# Altium project OLED_Xplained_PRO.PrjPCB
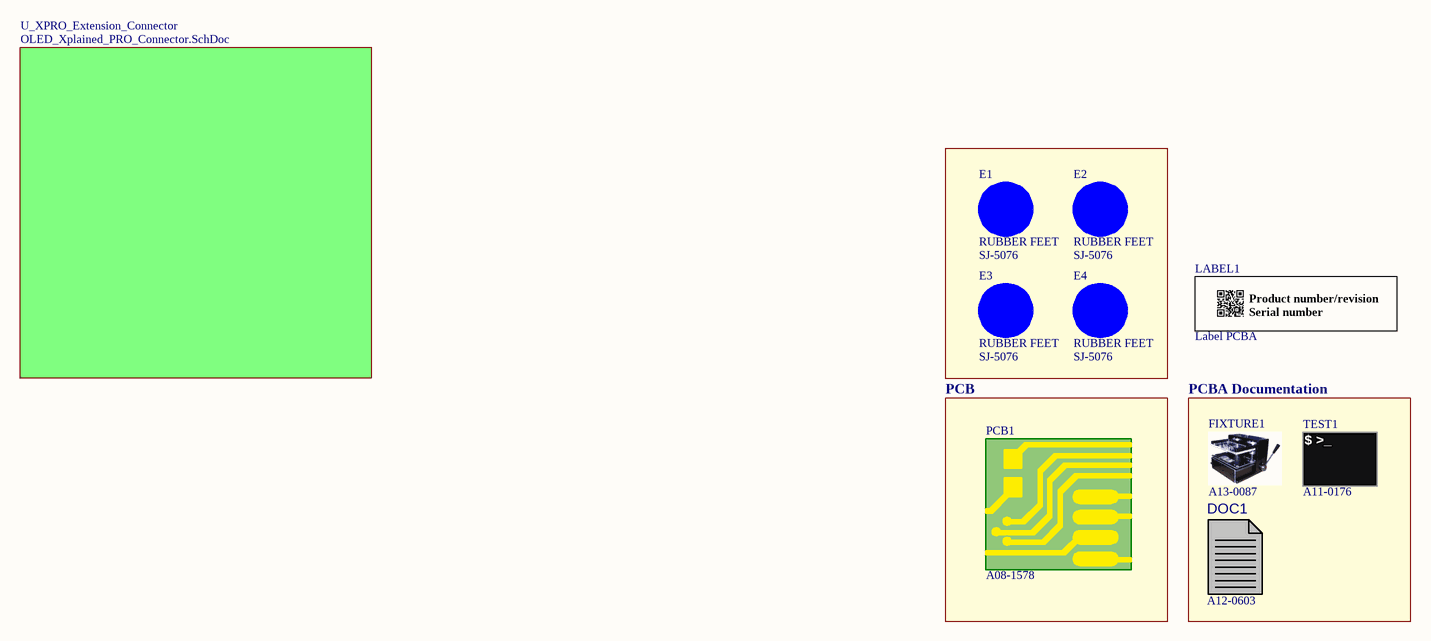
[diagram p0: OLED_Xplained_PRO_TopLevel.SchDoc]
2 sheets, 41 parts. Net scope: global (net labels, ports and power ports of the same name join across sheets).
Board file: OLED_Xplained_PRO.PcbDoc
Sheets:
  OLED_Xplained_PRO_TopLevel.SchDoc
    U_XPRO_Extension_Connector = OLED_Xplained_PRO_Connector.SchDoc

## Sheet OLED_Xplained_PRO_TopLevel.SchDoc: OLED Xplained PRO
size A3; Organization: ATMEL Norway; Address1: Vestre Rosten 79; Address2: N-7075 TILLER; Address3: NORWAY; DocumentNumber: 1; Revision: 3; SheetNumber: 1; SheetTotal: 2; PageSetup: Record=PageOptions|CenterHorizontal=True|CenterVertical=True|PrintScale=1.01|XCorrection=1.00|YCorrection=1.00|PrintKind=1|BorderSize=5000000|LeftOffset=0|BottomOffset=0|Orientation=2|PaperLength=1000|PaperWidth=1000|Scale=100|PaperSource=7|PrintQuality=-4|MediaType=1|DitherType=10|PaperKind=Letter|PrintScaleMode=1

### Parts
DOC1  AN: A12-0603  (hidden comment: PCBA Documentation)  (mechanical)
E1  RUBBER FEET  value SJ-5076  [AP8-00192]
E2  RUBBER FEET  value SJ-5076  [AP8-00192]
E3  RUBBER FEET  value SJ-5076  [AP8-00192]
E4  RUBBER FEET  value SJ-5076  [AP8-00192]
FIXTURE1  AN: A13-0087  (hidden comment: JIG)  (mechanical)
LABEL1  value Label PCBA  [AP8-00317]  (hidden comment: PCBA_LABEL)
PCB1  value A08-1578  (mechanical)
TEST1  AN: A11-0176  (hidden comment: TEST)  (mechanical)

### Blocks framed on the sheet
PCB: PCB1
PCBA Documentation: DOC1 FIXTURE1 TEST1

### Sub-sheets
U_XPRO_Extension_Connector = OLED_Xplained_PRO_Connector.SchDoc: no entries

### Nets

Not connected (* = marked no-connect by the designer): E1 1(FIDUCIAL); E2 1(FIDUCIAL); E3 1(FIDUCIAL); E4 1(FIDUCIAL)

### Notes on the sheet
- Date:
- PAGE:
- of
- TITLE:
- Document number:
- Revision:
- (in symbol A09-0611) / Product number/revision / Serial number
- (in symbol A11-0176) $ >_

### Library data of the parts
DOC1 = A12-0603: OLED1 Xplained Pro PCBA documentation; PartGroup: Documentation,PCBA Documents,Atmel; Manufacturer: ATMEL; Value: A09-1769 PCBA Files
E1-E4 = A08-0053: 2.8mm adhesive feet,diam 8.0mm; PartGroup: Mechanical devices,Mounting accessories; Manufacturer: 3M; AN: A08-0053; Height: 2,79999995231628; MPN: SJ-5076
FIXTURE1 = A13-0087: Xplained PRO Extension board Jupiter Test Fixture; PartGroup: Test Equipment,Test Fixtures; Manufacturer: ESCATEC; Value: Xplained PRO Extension board Jupiter Test Fixture; MPN: Xplained PRO Extension board Jupiter Test Fixture
LABEL1 = A09-0611: PCBA identification label PP Top White Gloss; PartGroup: Mechanical devices,Packaging materials,Printed Labels; Manufacturer: ACT Logimark AS; MPN: 505462; AN: A09-0611
PCB1 = A08-1578: OLED1 Xplained Pro PCB, 2 layer, size 60mm x 66.5mm; PartGroup: Mechanical devices,Printed circuit boards; Manufacturer: NCAB; AN: A08-1578; Height: 1.60000002384186
TEST1 = A11-0176: Fixture test for OLED1 Xplained PRO; PartGroup: Software,Test software,Starter Kit; Manufacturer: ATMEL; Value: OLED1 Xplained PRO test

## Sheet OLED_Xplained_PRO_Connector.SchDoc: OLED Xplained PRO
size A3; Organization: ATMEL Norway; Address1: Vestre Rosten 79; Address2: N-7075 TILLER; Address3: NORWAY; DocumentNumber: 2; Revision: 3; SheetNumber: 2; SheetTotal: 2; PageSetup: Record=PageOptions|CenterHorizontal=True|CenterVertical=True|PrintScale=1.01|XCorrection=1.00|YCorrection=1.00|PrintKind=1|BorderSize=5000000|LeftOffset=0|BottomOffset=0|Orientation=2|PaperLength=1000|PaperWidth=1000|Scale=100|PaperSource=7|PrintQuality=-4|MediaType=1|DitherType=10|PaperKind=A3 (297 x 420 mm)|PrintScaleMode=1
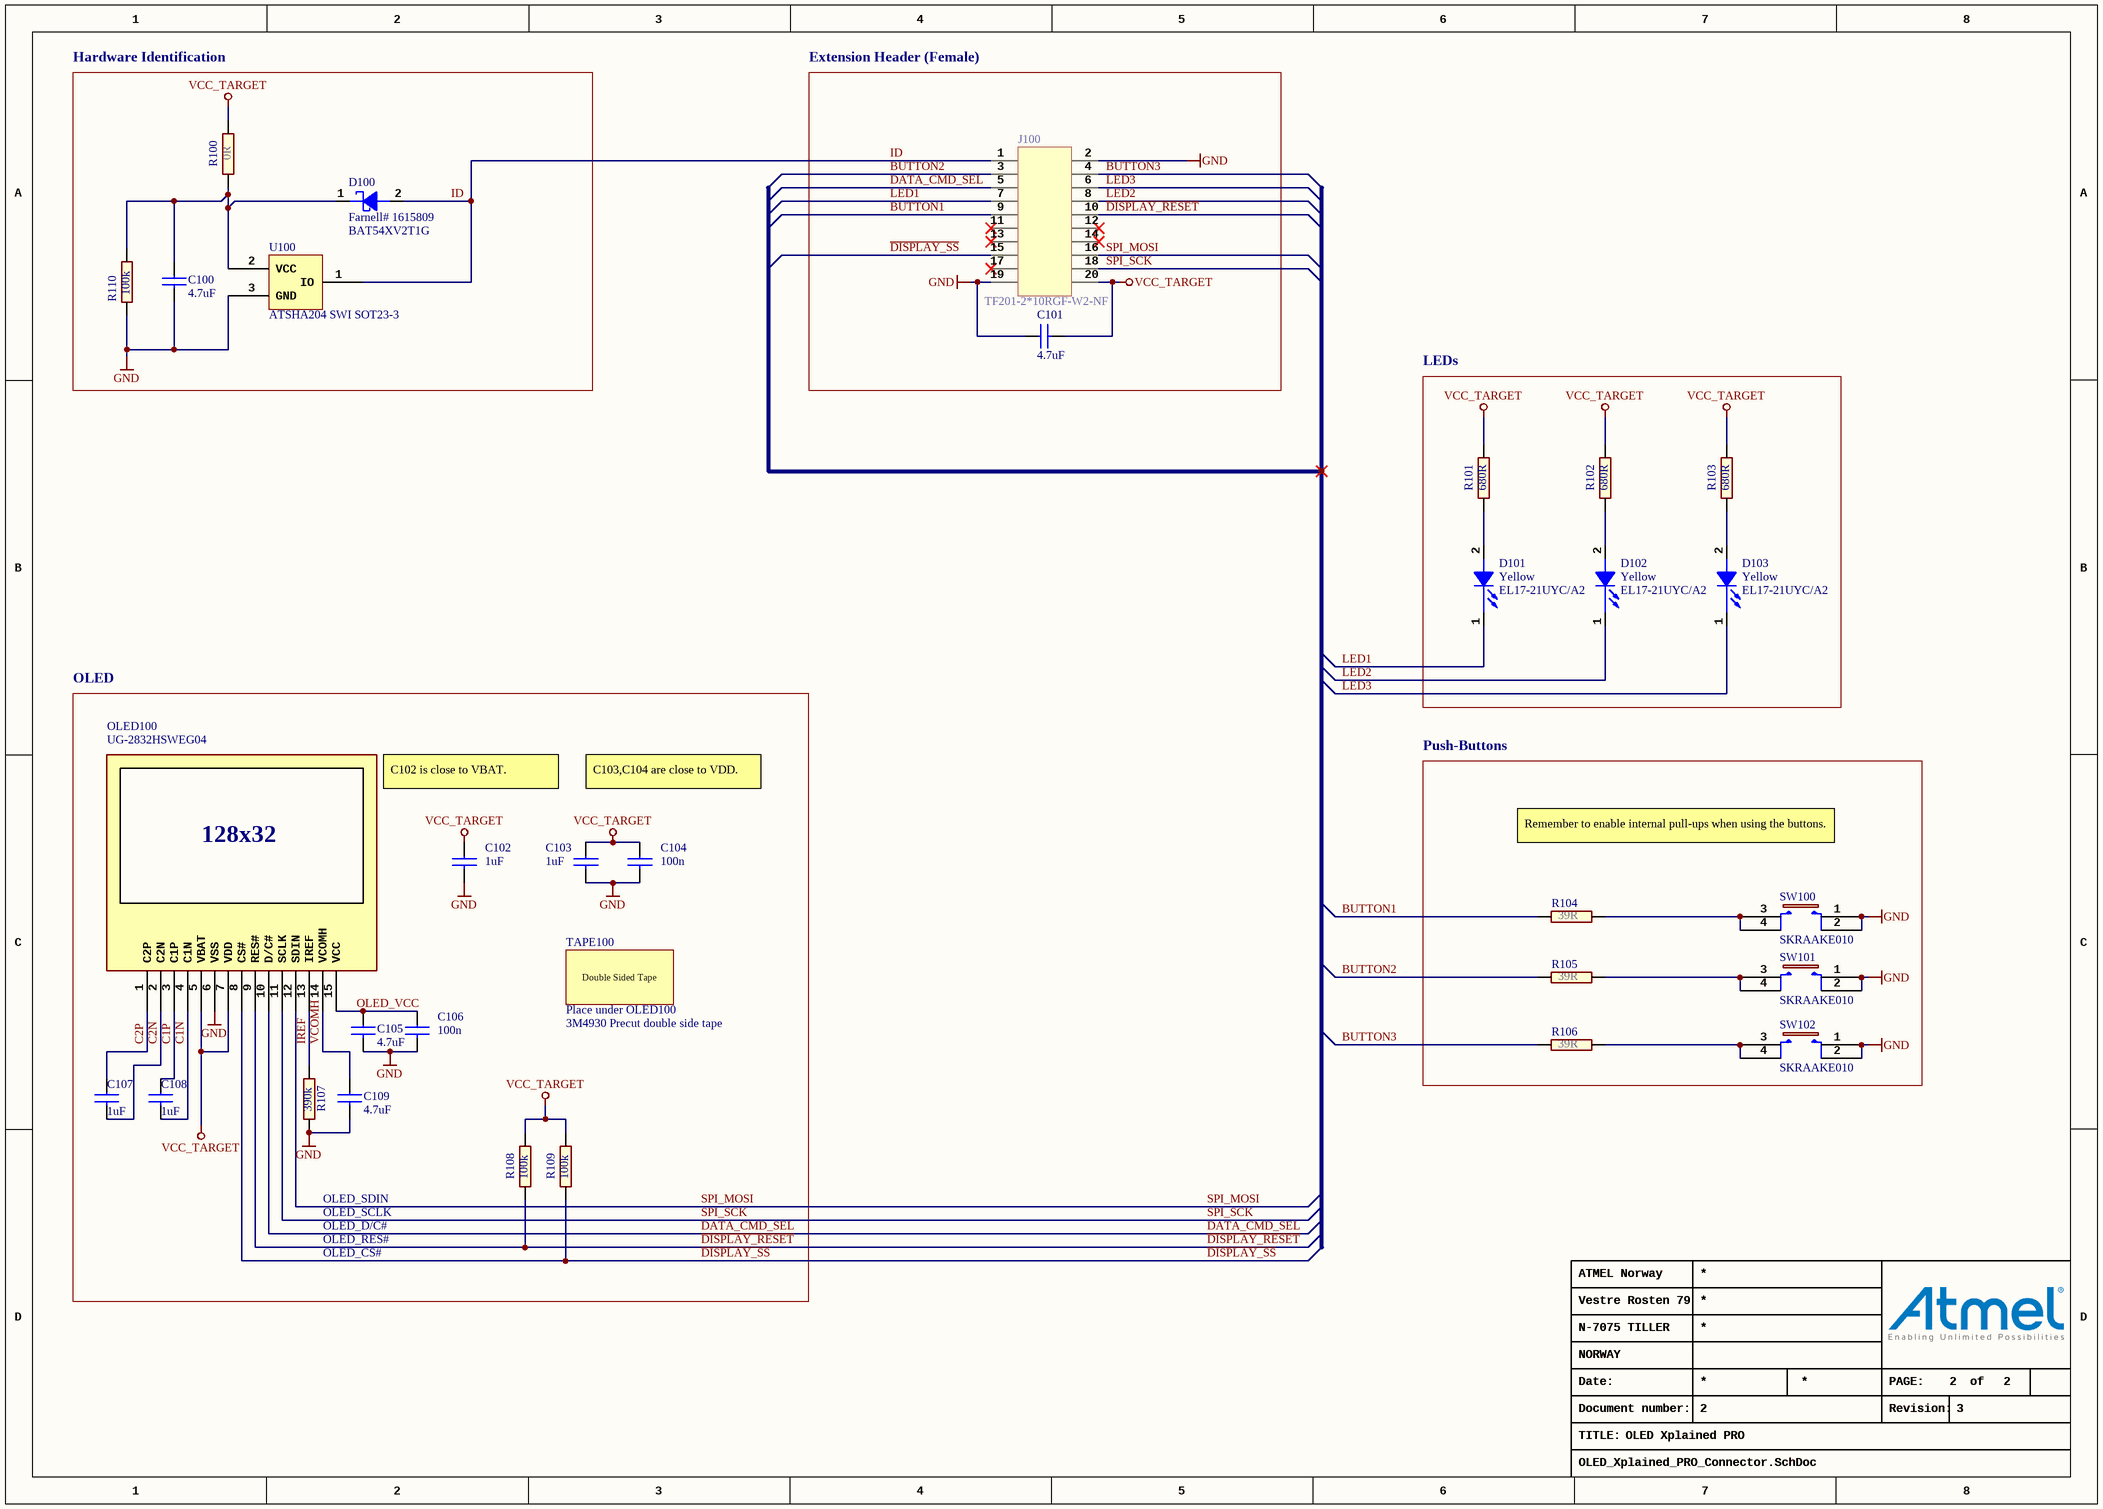
[diagram p1: OLED_Xplained_PRO_Connector.SchDoc]

### Parts
C100  value 4.7uF  [AP1-00001]  (hidden comment: CAP-NONPOL)
C101  value 4.7uF  [AP1-00001]  (hidden comment: CAP-NONPOL)
C102  1uF  [AP1-00039]
C103  1uF  [AP1-00039]
C104  100n  [AP1-00001]
C105  value 4.7uF  [AP1-00003]  (hidden comment: Generic part, no manufacturer specified.)
C106  100n  [AP1-00001]
C107  1uF  [AP1-00039]
C108  1uF  [AP1-00039]
C109  value 4.7uF  [AP1-00003]  (hidden comment: Generic part, no manufacturer specified.)
D100  Farnell# 1615809  value BAT54XV2T1G  [AP4-00036]
D101  Yellow  value EL17-21UYC/A2  [AP4-00013]
D102  Yellow  value EL17-21UYC/A2  [AP4-00013]
D103  Yellow  value EL17-21UYC/A2  [AP4-00013]
J100  value TF201-2*10RGF-W2-NF  [AP8-00621]  (hidden comment: HEADER-2X10)
OLED100  UG-2832HSWEG04  [AP9-00080]
R100  value 0R  [AP2-00000]  (hidden comment: R2)
R101  value 680R  [AP2-00000]  (hidden comment: R2)
R102  value 680R  [AP2-00000]  (hidden comment: R2)
R103  value 680R  [AP2-00000]  (hidden comment: R2)
R104  value 39R  [AP2-00000]  (hidden comment: R2)
R105  value 39R  [AP2-00000]  (hidden comment: R2)
R106  value 39R  [AP2-00000]  (hidden comment: R2)
R107  390k  [AP2-00000]
R108  100k  [AP2-00000]
R109  100k  [AP2-00000]
R110  value 100k  [AP2-00000]  (hidden comment: R2)
SW100  SKRAAKE010  [AP8-00137]
SW101  SKRAAKE010  [AP8-00137]
SW102  SKRAAKE010  [AP8-00137]
TAPE100  Place under OLED100  value 3M4930 Precut double side tape
U100  value ATSHA204 SWI SOT23-3  [AP4-00018]  (hidden comment: ATSHA204_SOT23)

### Blocks framed on the sheet
Hardware Identification: C100 D100 R100 R110 U100
Extension Header (Female): C101 J100
LEDs: D101-D103 R101-R103
OLED: C102-C109 OLED100 R107-R109 TAPE100
Push-Buttons: R104-R106 SW100-SW102

### Nets
GND: C100.2 C101.1 C102.2 C103.2 C104.2 C105.2 C106.2 C109.2 J100.2 J100.19 OLED100.6(VSS) R107.2 R110.1 SW100.1 SW100.2 SW101.1 SW101.2 SW102.1 SW102.2 U100.3(GND)
VCC_TARGET: C101.2 C102.1 C103.1 C104.1 J100.20 OLED100.5(VBAT) OLED100.7(VDD) R100.2 R101.2 R102.2 R103.2 R108.2 R109.2
BUTTON1: J100.9 R104.1
BUTTON2: J100.3 R105.1
BUTTON3: J100.4 R106.1
C1N: C108.2 OLED100.4(C1N)
C1P: C108.1 OLED100.3(C1P)
C2N: C107.2 OLED100.2(C2N)
C2P: C107.1 OLED100.1(C2P)
~{DISPLAY_RESET}: J100.10 OLED100.9(RES#) R108.1
~{DISPLAY_SS}: J100.15 OLED100.8(CS#) R109.1
DATA_CMD_SEL: J100.5 OLED100.10(D/C#)
ID: D100.2(ANODE) J100.1 U100.1(IO)
IREF: OLED100.13(IREF) R107.1
LED1: D101.1(CATHODE) J100.7
LED2: D102.1(CATHODE) J100.8
LED3: D103.1(CATHODE) J100.6
OLED_VCC: C105.1 C106.1 OLED100.15(VCC)
SPI_MOSI: J100.16 OLED100.12(SDIN)
SPI_SCK: J100.18 OLED100.11(SCLK)
VCOMH: C109.1 OLED100.14(VCOMH)
NetC100_1: C100.1 D100.1(CATHODE) R100.1 R110.2 U100.2(VCC)
NetD101_2: D101.2(ANODE) R101.1
NetD102_2: D102.2(ANODE) R102.1
NetD103_2: D103.2(ANODE) R103.1
NetR104_2: R104.2 SW100.3 SW100.4
NetR105_2: R105.2 SW101.3 SW101.4
NetR106_2: R106.2 SW102.3 SW102.4

Not connected (* = marked no-connect by the designer): J100 11* 12* 13* 14* 17*

### Notes on the sheet
- C102 is close to VBAT.
- C103,C104 are close to VDD.
- Remember to enable internal pull-ups when using the buttons.
- OLED_CS#
- OLED_RES#
- OLED_D/C#
- OLED_SCLK
- OLED_SDIN
- Date:
- PAGE:
- of
- TITLE:
- Document number:
- Revision:
- (in symbol A08-1622) Double Sided Tape
- (in symbol A10-0089) 128x32

### Library data of the parts
C100 C101 = A01-0485: Ceramic capacitor, SMD 0402, X5R, 6.3V, +/-10%; PartGroup: Capacitors,Ceramic,SMD 0402; Manufacturer: tdk; MPN: C1005X5R0J475K; Tolerance: ±10%; TemperatureRange: -55°C to +85°C; AN: A01-0485; Height: 0,5
C102 C103 C107 C108 = A01-0353: Ceramic capacitor, SMD 0603, X5R, 16V, 10% (de19763); PartGroup: Capacitors,Ceramic,SMD 0603; Manufacturer: Murata; MPN: GRM188R61C105KA12D; TemperatureRange: -55 - +85 deg C; AN: A01-0353; Value: 1uF; Tolerance: 10%
C104 C106 = A01-0246: Ceramic capacitor, SMD 0402, X7R, 16V, +/-10%; PartGroup: Capacitors,Ceramic,SMD 0402; Manufacturer: Kemet; MPN: C0402C104K4RACTU; TemperatureRange: -55 - +125 deg C; AN: A01-0246; Value: 100n; Tolerance: 16V, +/-10%; Height: 0.5
C105 C109 = A01-0486: Ceramic capacitor, SMD 0805, X7R, 16V, 10%,; PartGroup: Capacitors,Ceramic,SMD 0805; TemperatureRange: -55 - +125 deg C; AN: A01-0486; Tolerance: 10%
D100 = A04-0049: Schottky diode, If:200mA, Vf:0.35V, Vrrm:30V, SOD-523; PartGroup: Diodes,Schottky; Manufacturer: ON Semiconductor; TemperatureRange: -55°C to +125°C; AN: A04-0049; Height: 0,699999988079071; MPN: BAT54XV2T1G
D101-D103 = A10-0019: LED, Yellow, Wave length=591nm, SMD 0805, ±70°; PartGroup: Opto,LEDs,SMD; Manufacturer: Everlight; MPN: 17-21UYC/S530-A3/TR8; TemperatureRange: -40 to +85 deg C; AN: A10-0019; Height: 1,10000002384186
J100 = A08-1512: 2x10, female pin header receptable, right-angled, 2.54mm pitch, THM, Pin In Paste; PartGroup: Mechanical devices,Connectors,Pin header receptacle; MPN: F201-2*10RGF-W2-NF; AN: A08-1512; Height: 5,07999992370605
OLED100 = A10-0089: OLEDisplay Module, 128x32 pixels; PartGroup: Opto,LCD; Manufacturer: WiseChip; AN: A10-0089; Value: UG-2832HSWEG04; Height: 1.45000004768372; MPN: UG-2832HSWEG04
R100 = A02-0163: Thick film resistor, SMD 0402, 1/16W, 1%; PartGroup: Resistors,SMD,0402 1%; TemperatureRange: -55 - +125 deg C; AN: A02-0163; Tolerance: 1 %; Height: 0,349999994039536
R101-R103 = A02-0208: Thick film resistor, SMD 0402, 1/16W, 1%; PartGroup: Resistors,SMD,0402 1%; TemperatureRange: -55 - +125 deg C; AN: A02-0208; Tolerance: 1 %; Height: 0,349999994039536
R104-R106 = A02-0178: Thick film resistor, SMD 0402, 1/16W, 1%; PartGroup: Resistors,SMD,0402 1%; TemperatureRange: -55 - +125 deg C; AN: A02-0178; Tolerance: 1 %; Height: 0,349999994039536
R107 = A02-0274: Thick film resistor, SMD 0402, 1/16W, 1%; PartGroup: Resistors,SMD,0402 1%; TemperatureRange: -55 - +125 deg C; AN: A02-0274; Value: 390k; Tolerance: 1 %; Height: 0.349999994039536
R108-R110 = A02-0260: Thick film resistor, SMD 0402, 1/16W, 1%; PartGroup: Resistors,SMD,0402 1%; TemperatureRange: -55 - +125 deg C; AN: A02-0260; Tolerance: 1 %; Height: 0.349999994039536
  R108 R109: Value: 100k
SW100-SW102 = A08-0790: 6.2x6.2 mm SMD tact switch, same as A08-0091 but less force is needed; PartGroup: Mechanical devices,Switches,SMD; Manufacturer: ALPS; TemperatureRange: -30 - +90 deg C; AN: A08-0790; Value: SKRAAKE010; Height: 5,09999990463257; MPN: SKRAAKE010
TAPE100 = A08-1622: Precut double sided tape with size 22(Length)x5(Width)x0.6(Height)mm; PartGroup: Mechanical devices,Mounting accessories,Other; Manufacturer: 3M; MPN: 3M4930; AN: A08-1622; Height: 0.639999985694885
U100 = A06-0571: ATSHA204 with 1-wire interface and SOT23-3 package; PartGroup: Integrated Circuits,Special function,Encryption; Manufacturer: ATMEL; MPN: ATSHA204-TSU-T; AN: A06-0571; Height: 1,12000000476837

## Assembly variants
Default_assembly: not fitted R100
ID powered through VTG: not fitted D100